# Altium schematic sheet DVK501.SchDoc: DVK501
size A3
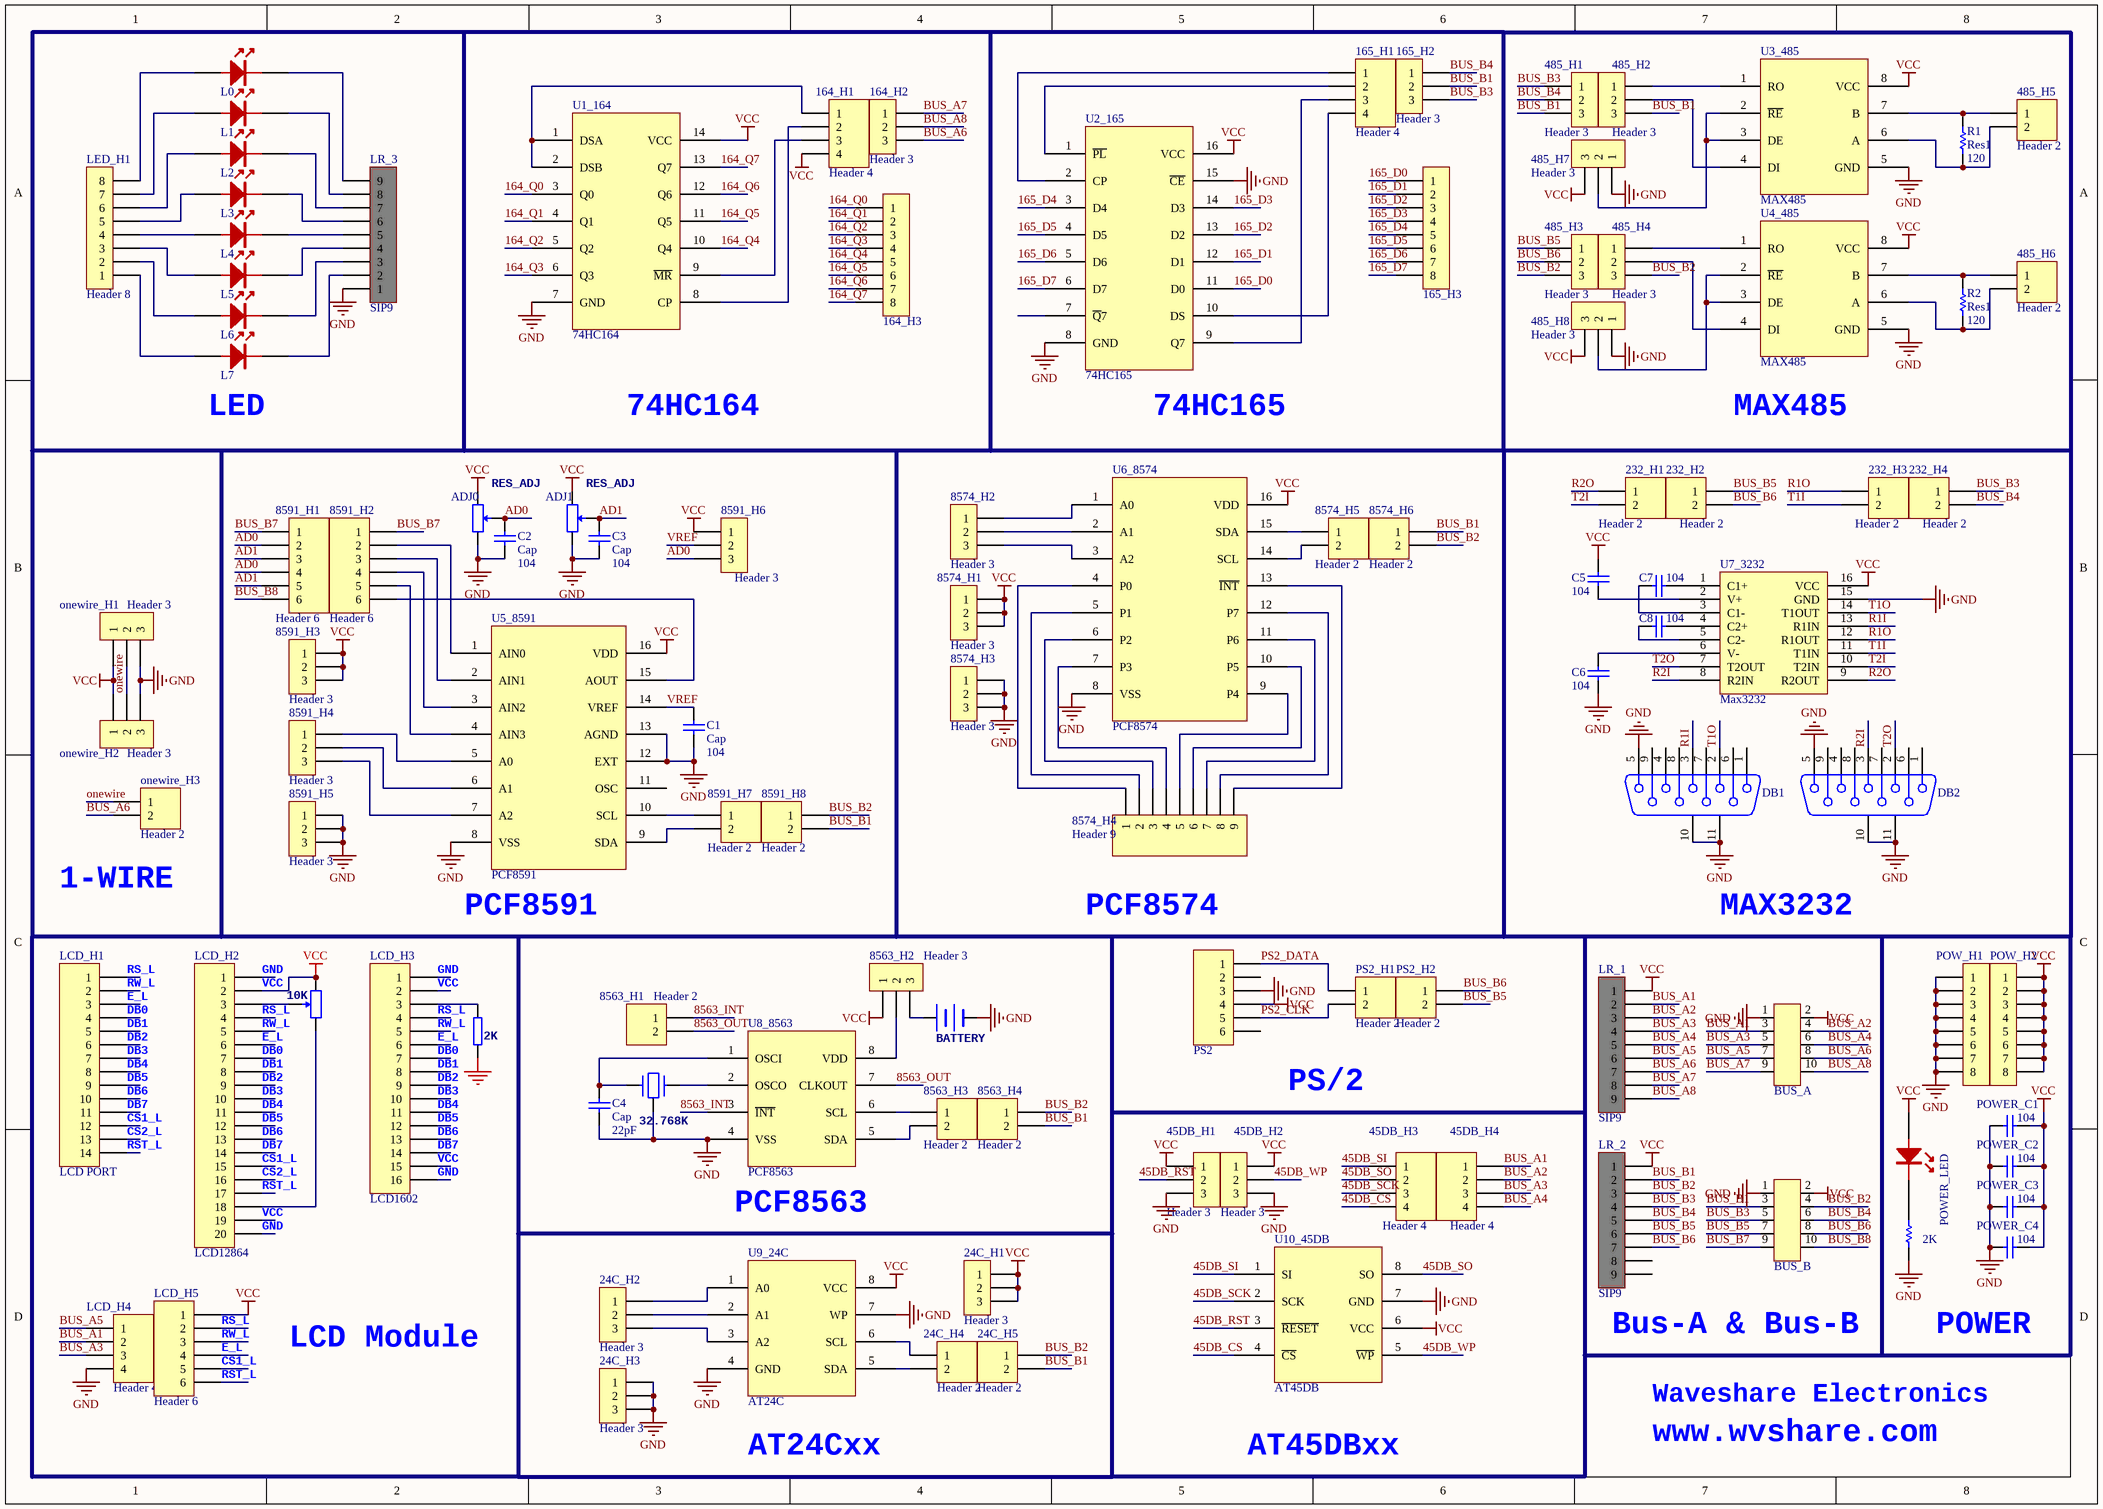
[diagram p0: DVK501.SchDoc]

## Parts
24C_H1  Header 3  [SIP3]
24C_H2  Header 3  [SIP3]
24C_H3  Header 3  [SIP3]
24C_H4  Header 2  [SIP2]
24C_H5  Header 2  [SIP2]
45DB_H1  Header 3  [SIP3]
45DB_H2  Header 3  [SIP3]
45DB_H3  Header 4  [SIP4]
45DB_H4  Header 4  [SIP4]
164_H1  Header 4  [SIP4]
164_H2  Header 3  [SIP3]
164_H3  Header 8  [SIP8]  (value not drawn)
165_H1  Header 4  [SIP4]
165_H2  Header 3  [SIP3]
165_H3  Header 8  [SIP8]  (value not drawn)
232_H1  Header 2  [SIP2]
232_H2  Header 2  [SIP2]
232_H3  Header 2  [SIP2]
232_H4  Header 2  [SIP2]
485_H1  Header 3  [SIP3]
485_H2  Header 3  [SIP3]
485_H3  Header 3  [SIP3]
485_H4  Header 3  [SIP3]
485_H5  Header 2  [SIP2]
485_H6  Header 2  [SIP2]
485_H7  Header 3  [SIP3]
485_H8  Header 3  [SIP3]
8563_H1  Header 2  [SIP2]
8563_H2  Header 3  [SIP3]
8563_H3  Header 2  [SIP2]
8563_H4  Header 2  [SIP2]
8574_H1  Header 3  [SIP3]
8574_H2  Header 3  [SIP3]
8574_H3  Header 3  [SIP3]
8574_H4  Header 9  [SIP9]
8574_H5  Header 2  [SIP2]
8574_H6  Header 2  [SIP2]
8591_H1  Header 6  [SIP6]
8591_H2  Header 6  [SIP6]
8591_H3  Header 3  [SIP3]
8591_H4  Header 3  [SIP3]
8591_H5  Header 3  [SIP3]
8591_H6  Header 3  [SIP3]
8591_H7  Header 2  [SIP2]
8591_H8  Header 2  [SIP2]
ADJ0  RES_ADJ  [RESADJ]
ADJ1  RES_ADJ  [RESADJ]
BT1  BATTERY  [BAT]
BUS_A  ISP10/JTAG  [ISP_10]  (value not drawn)
BUS_B  ISP10/JTAG  [ISP_10]  (value not drawn)
C1  Cap  value 104  [0805]
C2  Cap  value 104  [0805]
C3  Cap  value 104  [0805]
C4  Cap  value 22pF  [0603]
C5  value 104  [0603]  (hidden comment: Cap)
C6  value 104  [0603]  (hidden comment: Cap)
C7  value 104  [0603]  (hidden comment: Cap)
C8  value 104  [0603]  (hidden comment: Cap)
DB1  D Connector 9  [DB9_2]  (value not drawn)
DB2  D Connector 9  [DB9_2]  (value not drawn)
L0  Led2  [0805_LED]  (value not drawn)
L1  Led2  [0805_LED]  (value not drawn)
L2  Led2  [0805_LED]  (value not drawn)
L3  Led2  [0805_LED]  (value not drawn)
L4  Led2  [0805_LED]  (value not drawn)
L5  Led2  [0805_LED]  (value not drawn)
L6  Led2  [0805_LED]  (value not drawn)
L7  Led2  [0805_LED]  (value not drawn)
LCD_H1  LCD PORT  [SIP14]
LCD_H2  LCD12864  [SIP20]
LCD_H3  LCD1602  [SIP16]
LCD_H4  Header 4  [SIP4]
LCD_H5  Header 6  [SIP6]
LED_H1  Header 8  [SIP8]
LR_1  SIP9  [SIP9]
LR_2  SIP9  [SIP9]
LR_3  SIP9  [SIP9]
onewire_H1  Header 3  [SIP3]
onewire_H2  Header 3  [SIP3]
onewire_H3  Header 2  [SIP2]
POW_H1  Header 8  [SIP8]  (value not drawn)
POW_H2  Header 8  [SIP8]  (value not drawn)
POWER_C1  value 104  [0805]  (hidden comment: Cap)
POWER_C2  value 104  [0805]  (hidden comment: Cap)
POWER_C3  value 104  [0805]  (hidden comment: Cap)
POWER_C4  value 104  [0805]  (hidden comment: Cap)
POWER_LED  Led2  [0805_LED]  (value not drawn)
PS2  Header 6  [PS2]  (value not drawn)
PS2_H1  Header 2  [SIP2]
PS2_H2  Header 2  [SIP2]
R1  Res1  value 120  [0603]
R2  Res1  value 120  [0603]
R3  2K  [0603]
R4  10K  [RESADJ]
R5  value 2K  [0603]  (hidden comment: Res1)
U1_164  74HC164  [74HC164]
U2_165  74HC165  [74HC165]
U3_485  MAX485  [MAX485]
U4_485  MAX485  [MAX485]
U5_8591  PCF8591  [PCF8591]
U6_8574  PCF8574  [PCF8574]
U7_3232  Max3232  [SOP16]
U8_8563  PCF8563  [PCF8563]
U9_24C  AT24C  [AT24C]
U10_45DB  AT45DB  [AT45DB]
X?  32.768K  [CRYSTAL3]

## Nets
GND: 24C_H3.1 24C_H3.2 24C_H3.3 45DB_H1.3 45DB_H2.3 485_H7.1 485_H8.1 8574_H3.1 8574_H3.2 8574_H3.3 8591_H5.1 8591_H5.2 8591_H5.3 ADJ0.3(B) ADJ1.3(B) BT1.2(-) BUS_A.1 BUS_B.1 C1.1 C2.1 C3.1 C4.1 C6.1 DB1.5 DB1.10(MH1) DB1.11(MH2) DB2.5 DB2.10(MH1) DB2.11(MH2) LCD_H2.1 LCD_H2.20 LCD_H3.1 LCD_H3.16 LCD_H4.4 LR_3.1 onewire_H1.3 onewire_H2.3 POW_H1.1 POW_H1.2 POW_H1.3 POW_H1.4 POW_H1.5 POW_H1.6 POW_H1.7 POW_H1.8 POWER_C1.1 POWER_C2.1 POWER_C3.1 POWER_C4.1 PS2.3 R3.2 R5.1 U1_164.7(GND) U2_165.8(GND) U2_165.15(~{CE}) U3_485.5(GND) U4_485.5(GND) U5_8591.8(VSS) U5_8591.12(EXT) U5_8591.13(AGND) U6_8574.8(VSS) U7_3232.15(GND) U8_8563.4(VSS) U9_24C.4(GND) U9_24C.7(WP) U10_45DB.7(GND) X?.3(GND)
VCC: 24C_H1.1 24C_H1.2 24C_H1.3 45DB_H1.1 45DB_H2.1 164_H1.4 485_H7.3 485_H8.3 8563_H2.1 8574_H1.1 8574_H1.2 8574_H1.3 8591_H3.1 8591_H3.2 8591_H3.3 8591_H6.1 ADJ0.1(A) ADJ1.1(A) BUS_A.2 BUS_B.2 C5.1 LCD_H2.2 LCD_H2.19 LCD_H3.2 LCD_H3.15 LCD_H5.1 LR_1.1 LR_2.1 onewire_H1.1 onewire_H2.1 POW_H2.1 POW_H2.2 POW_H2.3 POW_H2.4 POW_H2.5 POW_H2.6 POW_H2.7 POW_H2.8 POWER_C1.2 POWER_C2.2 POWER_C3.2 POWER_C4.2 POWER_LED.1 PS2.4 R4.1(A) U1_164.14(VCC) U2_165.16(VCC) U3_485.8(VCC) U4_485.8(VCC) U5_8591.16(VDD) U6_8574.16(VDD) U7_3232.16(VCC) U9_24C.8(VCC) U10_45DB.6(VCC)
45DB_CS: 45DB_H3.4 U10_45DB.4(~{CS})
45DB_RST: 45DB_H1.2 U10_45DB.3(~{RESET})
45DB_SCK: 45DB_H3.3 U10_45DB.2(SCK)
45DB_SI: 45DB_H3.1 U10_45DB.1(SI)
45DB_SO: 45DB_H3.2 U10_45DB.8(SO)
45DB_WP: 45DB_H2.2 U10_45DB.5(~{WP})
164_Q0: 164_H3.1 U1_164.3(Q0)
164_Q1: 164_H3.2 U1_164.4(Q1)
164_Q2: 164_H3.3 U1_164.5(Q2)
164_Q3: 164_H3.4 U1_164.6(Q3)
164_Q4: 164_H3.5 U1_164.10(Q4)
164_Q5: 164_H3.6 U1_164.11(Q5)
164_Q6: 164_H3.7 U1_164.12(Q6)
164_Q7: 164_H3.8 U1_164.13(Q7)
165_D0: 165_H3.1 U2_165.11(D0)
165_D1: 165_H3.2 U2_165.12(D1)
165_D2: 165_H3.3 U2_165.13(D2)
165_D3: 165_H3.4 U2_165.14(D3)
165_D4: 165_H3.5 U2_165.3(D4)
165_D5: 165_H3.6 U2_165.4(D5)
165_D6: 165_H3.7 U2_165.5(D6)
165_D7: 165_H3.8 U2_165.6(D7)
8563_INT: 8563_H1.1 U8_8563.3(~{INT})
8563_OUT: 8563_H1.2 U8_8563.7(CLKOUT)
AD0: 8591_H1.2 8591_H1.4 8591_H6.3 ADJ0.2(TAP) C2.2
AD1: 8591_H1.3 8591_H1.5 ADJ1.2(TAP) C3.2
BUS_A1: 45DB_H4.1 BUS_A.3 LCD_H4.2 LR_1.2
BUS_A2: 45DB_H4.2 BUS_A.4 LR_1.3
BUS_A3: 45DB_H4.3 BUS_A.5 LCD_H4.3 LR_1.4
BUS_A4: 45DB_H4.4 BUS_A.6 LR_1.5
BUS_A5: BUS_A.7 LCD_H4.1 LR_1.6
BUS_A6: 164_H2.3 BUS_A.8 LR_1.7 onewire_H3.2
BUS_A7: 164_H2.1 BUS_A.9 LR_1.8
BUS_A8: 164_H2.2 BUS_A.10 LR_1.9
BUS_B1: 24C_H5.2 165_H2.2 485_H1.3 485_H2.3 8563_H4.2 8574_H6.1 8591_H8.2 BUS_B.3 LR_2.2
BUS_B2: 24C_H5.1 485_H3.3 485_H4.3 8563_H4.1 8574_H6.2 8591_H8.1 BUS_B.4 LR_2.3
BUS_B3: 165_H2.3 232_H4.1 485_H1.1 BUS_B.5 LR_2.4
BUS_B4: 165_H2.1 232_H4.2 485_H1.2 BUS_B.6 LR_2.5
BUS_B5: 232_H2.1 485_H3.1 BUS_B.7 LR_2.6 PS2_H2.2
BUS_B6: 232_H2.2 485_H3.2 BUS_B.8 LR_2.7 PS2_H2.1
BUS_B7: 8591_H1.1 8591_H2.1 BUS_B.9
BUS_B8: 8591_H1.6 BUS_B.10
CS1_L: LCD_H1.12 LCD_H2.15 LCD_H5.5
CS2_L: LCD_H1.13 LCD_H2.16
DB0: LCD_H1.4 LCD_H2.7 LCD_H3.7
DB1: LCD_H1.5 LCD_H2.8 LCD_H3.8
DB2: LCD_H1.6 LCD_H2.9 LCD_H3.9
DB3: LCD_H1.7 LCD_H2.10 LCD_H3.10
DB4: LCD_H1.8 LCD_H2.11 LCD_H3.11
DB5: LCD_H1.9 LCD_H2.12 LCD_H3.12
DB6: LCD_H1.10 LCD_H2.13 LCD_H3.13
DB7: LCD_H1.11 LCD_H2.14 LCD_H3.14
E_L: LCD_H1.3 LCD_H2.6 LCD_H3.6 LCD_H5.4
onewire: onewire_H1.2 onewire_H2.2 onewire_H3.1
PS2_CLK: PS2.5 PS2_H1.2
PS2_DATA: PS2.1 PS2_H1.1
R1I: DB1.3 U7_3232.13(R1IN)
R1O: 232_H3.1 U7_3232.12(R1OUT)
R2I: DB2.3 U7_3232.8(R2IN)
R2O: 232_H1.1 U7_3232.9(R2OUT)
RS_L: LCD_H1.1 LCD_H2.4 LCD_H3.4 LCD_H5.2
RST_L: LCD_H1.14 LCD_H2.17 LCD_H5.6
RW_L: LCD_H1.2 LCD_H2.5 LCD_H3.5 LCD_H5.3
T1I: 232_H3.2 U7_3232.11(T1IN)
T1O: DB1.2 U7_3232.14(T1OUT)
T2I: 232_H1.2 U7_3232.10(T2IN)
T2O: DB2.2 U7_3232.7(T2OUT)
VREF: 8591_H6.2 C1.2 U5_8591.14(VREF)
Net24C_H2_1: 24C_H2.1 U9_24C.1(A0)
Net24C_H2_2: 24C_H2.2 U9_24C.2(A1)
Net24C_H2_3: 24C_H2.3 U9_24C.3(A2)
Net24C_H4_1: 24C_H4.1 U9_24C.6(SCL)
Net24C_H4_2: 24C_H4.2 U9_24C.5(SDA)
Net164_H1_1: 164_H1.1 U1_164.1(DSA) U1_164.2(DSB)
Net164_H1_2: 164_H1.2 U1_164.8(CP)
Net164_H1_3: 164_H1.3 U1_164.9(~{MR})
Net165_H1_1: 165_H1.1 U2_165.2(CP)
Net165_H1_2: 165_H1.2 U2_165.1(~{PL})
Net165_H1_3: 165_H1.3 U2_165.9(Q7)
Net165_H1_4: 165_H1.4 U2_165.10(DS)
Net485_H2_1: 485_H2.1 U3_485.1(RO)
Net485_H2_2: 485_H2.2 U3_485.4(DI)
Net485_H4_1: 485_H4.1 U4_485.1(RO)
Net485_H4_2: 485_H4.2 U4_485.4(DI)
Net485_H5_1: 485_H5.1 R1.2 U3_485.7(B)
Net485_H5_2: 485_H5.2 R1.1 U3_485.6(A)
Net485_H6_1: 485_H6.1 R2.2 U4_485.7(B)
Net485_H6_2: 485_H6.2 R2.1 U4_485.6(A)
Net485_H7_2: 485_H7.2 U3_485.2(~{RE}) U3_485.3(DE)
Net485_H8_2: 485_H8.2 U4_485.2(~{RE}) U4_485.3(DE)
Net8563_H2_2: 8563_H2.2 U8_8563.8(VDD)
Net8563_H2_3: 8563_H2.3 BT1.1(+)
Net8563_H3_1: 8563_H3.1 U8_8563.6(SCL)
Net8563_H3_2: 8563_H3.2 U8_8563.5(SDA)
Net8574_H2_1: 8574_H2.1 U6_8574.1(A0)
Net8574_H2_2: 8574_H2.2 U6_8574.2(A1)
Net8574_H2_3: 8574_H2.3 U6_8574.3(A2)
Net8574_H4_1: 8574_H4.1 U6_8574.4(P0)
Net8574_H4_2: 8574_H4.2 U6_8574.5(P1)
Net8574_H4_3: 8574_H4.3 U6_8574.6(P2)
Net8574_H4_4: 8574_H4.4 U6_8574.7(P3)
Net8574_H4_5: 8574_H4.5 U6_8574.9(P4)
Net8574_H4_6: 8574_H4.6 U6_8574.10(P5)
Net8574_H4_7: 8574_H4.7 U6_8574.11(P6)
Net8574_H4_8: 8574_H4.8 U6_8574.12(P7)
Net8574_H4_9: 8574_H4.9 U6_8574.13(~{INT})
Net8574_H5_1: 8574_H5.1 U6_8574.15(SDA)
Net8574_H5_2: 8574_H5.2 U6_8574.14(SCL)
Net8591_H2_2: 8591_H2.2 U5_8591.1(AIN0)
Net8591_H2_3: 8591_H2.3 U5_8591.2(AIN1)
Net8591_H2_4: 8591_H2.4 U5_8591.3(AIN2)
Net8591_H2_5: 8591_H2.5 U5_8591.4(AIN3)
Net8591_H2_6: 8591_H2.6 U5_8591.15(AOUT)
Net8591_H4_1: 8591_H4.1 U5_8591.5(A0)
Net8591_H4_2: 8591_H4.2 U5_8591.6(A1)
Net8591_H4_3: 8591_H4.3 U5_8591.7(A2)
Net8591_H7_1: 8591_H7.1 U5_8591.10(SCL)
Net8591_H7_2: 8591_H7.2 U5_8591.9(SDA)
NetC4_2: C4.2 U8_8563.1(OSCI) X?.2
NetC5_2: C5.2 U7_3232.2(V+)
NetC6_2: C6.2 U7_3232.6(V-)
NetC7_1: C7.1 U7_3232.3(C1-)
NetC7_2: C7.2 U7_3232.1(C1+)
NetC8_1: C8.1 U7_3232.5(C2-)
NetC8_2: C8.2 U7_3232.4(C2+)
NetL0_1: L0.1 LED_H1.8
NetL0_2: L0.2 LR_3.9
NetL1_1: L1.1 LED_H1.7
NetL1_2: L1.2 LR_3.8
NetL2_1: L2.1 LED_H1.6
NetL2_2: L2.2 LR_3.7
NetL3_1: L3.1 LED_H1.5
NetL3_2: L3.2 LR_3.6
NetL4_1: L4.1 LED_H1.4
NetL4_2: L4.2 LR_3.5
NetL5_1: L5.1 LED_H1.3
NetL5_2: L5.2 LR_3.4
NetL6_1: L6.1 LED_H1.2
NetL6_2: L6.2 LR_3.3
NetL7_1: L7.1 LED_H1.1
NetL7_2: L7.2 LR_3.2
NetLCD_H2_3: LCD_H2.3 R4.2(TAP)
NetLCD_H2_18: LCD_H2.18 R4.3(B)
NetLCD_H3_3: LCD_H3.3 R3.1
NetPOWER_LED_2: POWER_LED.2 R5.2
NetU8_8563_2: U8_8563.2(OSCO) X?.1

Not connected (* = marked no-connect by the designer): DB1 1 4 6 7 8 9; DB2 1 4 6 7 8 9; LR_2 8 9; PS2 2 6; U2_165 7(~{Q}7); U5_8591 11(OSC)

## Notes on the sheet
- (near L7) LED
- 74HC164
- (near U2_165) 74HC165
- MAX485
- (near onewire_H3) 1-WIRE
- (near U5_8591) PCF8591
- PCF8574
- MAX3232
- PS/2
- PCF8563
- LCD Module
- (near LR_2) Bus-A & Bus-B
- POWER
- AT24Cxx
- AT45DBxx
- www.wvshare.com
- Waveshare Electronics

## Library data of the parts
24C_H1-24C_H3 45DB_H1 45DB_H2 164_H2 165_H2 485_H1-485_H4 485_H7 485_H8 8563_H2 8574_H1-8574_H3 8591_H3-8591_H6 onewire_H1 onewire_H2 = Header 3: Header, 3-Pin
24C_H4 24C_H5 232_H1-232_H4 485_H5 485_H6 8563_H1 8563_H3 8563_H4 8574_H5 8574_H6 8591_H7 8591_H8 onewire_H3 PS2_H1 PS2_H2 = Header 2: Header, 2-Pin; LatestRevisionDate: 17-Jul-2002; LatestRevisionNote: Re-released for DXP Platform.; Publisher: Altium Limited
45DB_H3 45DB_H4 164_H1 165_H1 LCD_H4 = Header 4: Header, 4-Pin; LatestRevisionDate: 17-Jul-2002; LatestRevisionNote: Re-released for DXP Platform.; Publisher: Altium Limited
164_H3 165_H3 LED_H1 POW_H1 POW_H2 = Header 8: Header, 8-Pin
8574_H4 = Header 9: Header, 9-Pin; LatestRevisionDate: 17-Jul-2002; LatestRevisionNote: Re-released for DXP Platform.; Publisher: Altium Limited
8591_H1 8591_H2 LCD_H5 PS2 = Header 6: Header, 6-Pin; LatestRevisionDate: 17-Jul-2002; LatestRevisionNote: Re-released for DXP Platform.; Publisher: Altium Limited
BUS_A BUS_B = ISP_10
C1-C8 POWER_C1-POWER_C4 = Cap: Capacitor; Published: 8-Jun-2000; LatestRevisionDate: 17-Jul-2002; LatestRevisionNote: Re-released for DXP Platform.; PackageReference: RAD-0.3; Publisher: Altium Limited
DB1 DB2 = D Connector 9: Receptacle Assembly, 9 Position, Right Angle; PackageDocument: O; Positions: 9; Published: 15-Jun-2001; LatestRevisionDate: 17-Jul-2002; LatestRevisionNote: Re-released for DXP Platform.; DatasheetDocument: 1-Sep-1999; PackageReference: 788750; Publisher: Altium Limited; Orientation: Right Angle; Gender: Receptacle
L0-L7 POWER_LED = LED
LCD_H1 = Header 14: Header, 14-Pin; LatestRevisionDate: 17-Jul-2002; LatestRevisionNote: Re-released for DXP Platform.; Publisher: Altium Limited
LCD_H2 = Header 20: Header, 20-Pin; LatestRevisionDate: 17-Jul-2002; LatestRevisionNote: Re-released for DXP Platform.; Publisher: Altium Limited
LCD_H3 = Header 16: Header, 16-Pin; LatestRevisionDate: 17-Jul-2002; LatestRevisionNote: Re-released for DXP Platform.; Publisher: Altium Limited
LR_1-LR_3 = LED_R: 8bit res
R1 R2 R5 = Res1: Resistor; Published: 8-Jun-2000; LatestRevisionDate: 17-Jul-2002; LatestRevisionNote: Re-released for DXP Platform.; PackageReference: AXIAL-0.3; Publisher: Altium Limited
R3 = RES
R4 = RES_3
X? = XTAL2: CRYSTAL